# Altium project Main_board.PrjPcb
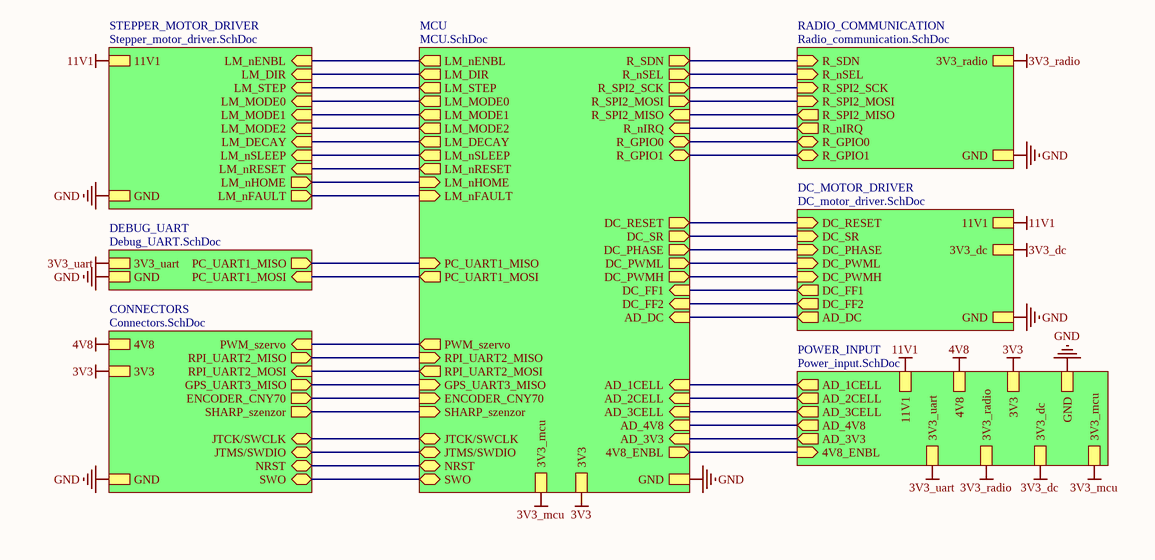
[diagram p0: TopLevelWiring.SchDoc]
8 sheets, 208 parts. Net scope: strictly hierarchical (ports join the sheet entries above them; power ports are local).
Board file: Main_board.PcbDoc
Sheets:
  TopLevelWiring.SchDoc
    CONNECTORS = Connectors.SchDoc
    DC_MOTOR_DRIVER = DC_motor_driver.SchDoc
    DEBUG_UART = Debug_UART.SchDoc
    RADIO_COMMUNICATION = Radio_communication.SchDoc
    STEPPER_MOTOR_DRIVER = Stepper_motor_driver.SchDoc
    POWER_INPUT = Power_input.SchDoc
    MCU = MCU.SchDoc

## Sheet TopLevelWiring.SchDoc
size A4; PageSetup: Record=PageOptions|CenterHorizontal=True|CenterVertical=True|PrintScale=1.00|XCorrection=1.00|YCorrection=1.00|PrintKind=0|BorderSize=5000000|LeftOffset=0|BottomOffset=0|Orientation=2|PaperLength=1000|PaperWidth=1000|Scale=100|PaperSource=7|PrintQuality=-3|MediaType=1|DitherType=10|PrintScaleMode=1|PaperKind=A4|PaperIndex=9

### Sub-sheets
CONNECTORS = Connectors.SchDoc: PWM_szervo (in), GND, 4V8, 3V3, RPI_UART2_MOSI (in), RPI_UART2_MISO (out), GPS_UART3_MISO (out), JTCK/SWCLK (bidir), JTMS/SWDIO (bidir), NRST (bidir), ENCODER_CNY70 (out), SWO (bidir), SHARP_szenzor (out)
DC_MOTOR_DRIVER = DC_motor_driver.SchDoc: 11V1, GND, DC_RESET (in), DC_SR (in), DC_PHASE (in), DC_PWML (in), DC_PWMH (in), DC_FF1 (out), DC_FF2 (out), AD_DC (out), 3V3_dc
DEBUG_UART = Debug_UART.SchDoc: 3V3_uart, GND, PC_UART1_MOSI (in), PC_UART1_MISO (out)
MCU = MCU.SchDoc: GND, LM_nENBL (out), LM_DIR (out), LM_STEP (out), LM_MODE0 (out), LM_MODE1 (out), LM_MODE2 (out), LM_DECAY (out), LM_nSLEEP (out), LM_nRESET (out), LM_nHOME (in), LM_nFAULT (in), R_SDN (out), R_nSEL (out), R_GPIO0 (bidir), R_GPIO1 (bidir), R_nIRQ (in), R_SPI2_SCK (out), R_SPI2_MISO (in), R_SPI2_MOSI (out), RPI_UART2_MOSI (out), RPI_UART2_MISO (in), GPS_UART3_MISO (in), PC_UART1_MOSI (out), PC_UART1_MISO (in), JTCK/SWCLK (bidir), JTMS/SWDIO (bidir), NRST (bidir), DC_RESET (out), DC_SR (out), DC_PHASE (out), DC_PWML (out), DC_PWMH (out), DC_FF1 (in), DC_FF2 (in), SWO (bidir), AD_3CELL (in), AD_4V8 (in), AD_3V3 (in), AD_2CELL (in), AD_1CELL (in), AD_DC (in), ENCODER_CNY70 (in), PWM_szervo (out), 4V8_ENBL (out), 3V3_mcu, 3V3, SHARP_szenzor (in)
POWER_INPUT = Power_input.SchDoc: 3V3, 4V8, 11V1, GND, AD_3CELL (out), AD_4V8 (out), AD_3V3 (out), AD_2CELL (out), AD_1CELL (out), 3V3_dc, 3V3_radio, 3V3_uart, 3V3_mcu, 4V8_ENBL (in)
RADIO_COMMUNICATION = Radio_communication.SchDoc: GND, R_SDN (in), R_nSEL (in), R_GPIO0 (bidir), R_GPIO1 (bidir), R_nIRQ (out), 3V3_radio, R_SPI2_SCK (in), R_SPI2_MISO (out), R_SPI2_MOSI (in)
STEPPER_MOTOR_DRIVER = Stepper_motor_driver.SchDoc: GND, LM_nENBL (in), LM_DIR (in), LM_STEP (in), LM_MODE0 (in), LM_MODE1 (in), LM_MODE2 (in), LM_DECAY (in), LM_nSLEEP (in), LM_nRESET (in), LM_nHOME (out), LM_nFAULT (out), 11V1

### Nets
3V3: sheet CONNECTORS/3V3, sheet POWER_INPUT/3V3, sheet MCU/3V3
3V3_dc: sheet DC_MOTOR_DRIVER/3V3_dc, sheet POWER_INPUT/3V3_dc
3V3_mcu: sheet POWER_INPUT/3V3_mcu, sheet MCU/3V3_mcu
3V3_radio: sheet RADIO_COMMUNICATION/3V3_radio, sheet POWER_INPUT/3V3_radio
3V3_uart: sheet DEBUG_UART/3V3_uart, sheet POWER_INPUT/3V3_uart
4V8: sheet CONNECTORS/4V8, sheet POWER_INPUT/4V8
11V1: sheet DC_MOTOR_DRIVER/11V1, sheet STEPPER_MOTOR_DRIVER/11V1, sheet POWER_INPUT/11V1
GND: sheet CONNECTORS/GND, sheet DC_MOTOR_DRIVER/GND, sheet DEBUG_UART/GND, sheet RADIO_COMMUNICATION/GND, sheet STEPPER_MOTOR_DRIVER/GND, sheet POWER_INPUT/GND, sheet MCU/GND
NetB1_2: sheet CONNECTORS/NRST, sheet MCU/NRST
NetGPS_3: sheet CONNECTORS/GPS_UART3_MISO, sheet MCU/GPS_UART3_MISO
NetIC2_7: sheet POWER_INPUT/4V8_ENBL, sheet MCU/4V8_ENBL
NetIC3_15: sheet DC_MOTOR_DRIVER/AD_DC, sheet MCU/AD_DC
NetIC3_16: sheet POWER_INPUT/AD_3V3, sheet MCU/AD_3V3
NetIC3_17: sheet POWER_INPUT/AD_1CELL, sheet MCU/AD_1CELL
NetIC3_18: sheet POWER_INPUT/AD_2CELL, sheet MCU/AD_2CELL
NetIC3_23: sheet CONNECTORS/PWM_szervo, sheet MCU/PWM_szervo
NetIC3_24: sheet CONNECTORS/ENCODER_CNY70, sheet MCU/ENCODER_CNY70
NetIC3_25: sheet CONNECTORS/RPI_UART2_MOSI, sheet MCU/RPI_UART2_MOSI
NetIC3_26: sheet CONNECTORS/RPI_UART2_MISO, sheet MCU/RPI_UART2_MISO
NetIC3_29: sheet POWER_INPUT/AD_3CELL, sheet MCU/AD_3CELL
NetIC3_30: sheet POWER_INPUT/AD_4V8, sheet MCU/AD_4V8
NetIC3_36: sheet CONNECTORS/SHARP_szenzor, sheet MCU/SHARP_szenzor
NetIC3_42: sheet RADIO_COMMUNICATION/R_SDN, sheet MCU/R_SDN
NetIC3_43: sheet RADIO_COMMUNICATION/R_nSEL, sheet MCU/R_nSEL
NetIC3_44: sheet RADIO_COMMUNICATION/R_GPIO0, sheet MCU/R_GPIO0
NetIC3_45: sheet RADIO_COMMUNICATION/R_GPIO1, sheet MCU/R_GPIO1
NetIC3_46: sheet RADIO_COMMUNICATION/R_nIRQ, sheet MCU/R_nIRQ
NetIC3_52: sheet RADIO_COMMUNICATION/R_SPI2_SCK, sheet MCU/R_SPI2_SCK
NetIC3_53: sheet RADIO_COMMUNICATION/R_SPI2_MISO, sheet MCU/R_SPI2_MISO
NetIC3_54: sheet RADIO_COMMUNICATION/R_SPI2_MOSI, sheet MCU/R_SPI2_MOSI
NetIC3_57: sheet STEPPER_MOTOR_DRIVER/LM_nHOME, sheet MCU/LM_nHOME
NetIC3_58: sheet STEPPER_MOTOR_DRIVER/LM_MODE2, sheet MCU/LM_MODE2
NetIC3_59: sheet STEPPER_MOTOR_DRIVER/LM_MODE1, sheet MCU/LM_MODE1
NetIC3_60: sheet STEPPER_MOTOR_DRIVER/LM_MODE0, sheet MCU/LM_MODE0
NetIC3_61: sheet STEPPER_MOTOR_DRIVER/LM_nENBL, sheet MCU/LM_nENBL
NetIC3_62: sheet STEPPER_MOTOR_DRIVER/LM_DIR, sheet MCU/LM_DIR
NetIC3_63: sheet STEPPER_MOTOR_DRIVER/LM_DECAY, sheet MCU/LM_DECAY
NetIC3_64: sheet STEPPER_MOTOR_DRIVER/LM_nFAULT, sheet MCU/LM_nFAULT
NetIC3_65: sheet STEPPER_MOTOR_DRIVER/LM_nSLEEP, sheet MCU/LM_nSLEEP
NetIC3_66: sheet STEPPER_MOTOR_DRIVER/LM_nRESET, sheet MCU/LM_nRESET
NetIC3_67: sheet STEPPER_MOTOR_DRIVER/LM_STEP, sheet MCU/LM_STEP
NetIC3_68: sheet DEBUG_UART/PC_UART1_MOSI, sheet MCU/PC_UART1_MOSI
NetIC3_69: sheet DEBUG_UART/PC_UART1_MISO, sheet MCU/PC_UART1_MISO
NetIC3_72: sheet CONNECTORS/JTMS/SWDIO, sheet MCU/JTMS/SWDIO
NetIC3_76: sheet CONNECTORS/JTCK/SWCLK, sheet MCU/JTCK/SWCLK
NetIC3_85: sheet DC_MOTOR_DRIVER/DC_FF2, sheet MCU/DC_FF2
NetIC3_86: sheet DC_MOTOR_DRIVER/DC_FF1, sheet MCU/DC_FF1
NetIC3_87: sheet DC_MOTOR_DRIVER/DC_RESET, sheet MCU/DC_RESET
NetIC3_88: sheet DC_MOTOR_DRIVER/DC_SR, sheet MCU/DC_SR
NetIC3_89: sheet CONNECTORS/SWO, sheet MCU/SWO
NetIC3_92: sheet DC_MOTOR_DRIVER/DC_PWMH, sheet MCU/DC_PWMH
NetIC3_93: sheet DC_MOTOR_DRIVER/DC_PWML, sheet MCU/DC_PWML
NetIC3_95: sheet DC_MOTOR_DRIVER/DC_PHASE, sheet MCU/DC_PHASE

## Sheet Connectors.SchDoc
size A4; PageSetup: Record=PageOptions|CenterHorizontal=True|CenterVertical=True|PrintScale=1.00|XCorrection=1.00|YCorrection=1.00|PrintKind=0|BorderSize=5000000|LeftOffset=0|BottomOffset=0|Orientation=2|PaperLength=1000|PaperWidth=1000|Scale=100|PaperSource=7|PrintQuality=-3|MediaType=1|DitherType=10|PrintScaleMode=1|PaperKind=A4|PaperIndex=9
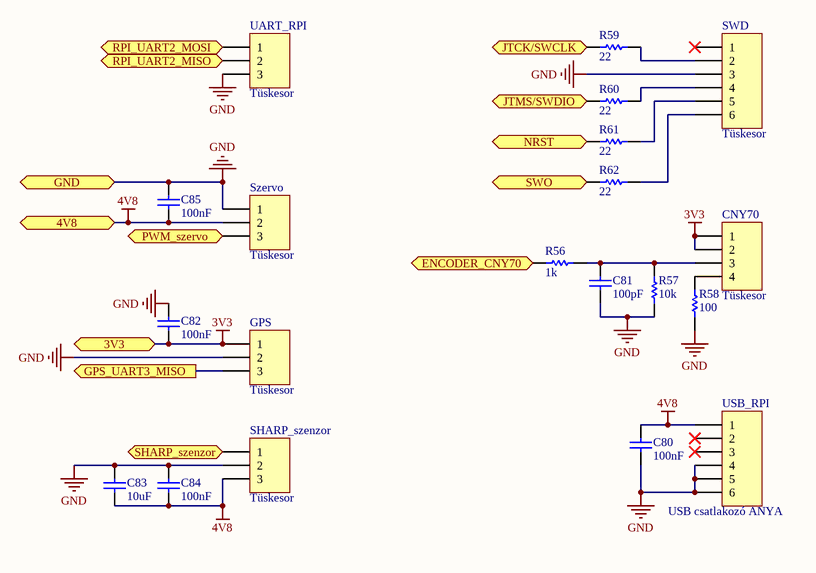
[diagram p1: Connectors.SchDoc]

### Parts
C80  value 100nF  [FP_0603_CAP_080]  (hidden comment: Cap)
C81  value 100pF  [FP_0603_CAP_080]  (hidden comment: Cap)
C82  value 100nF  [FP_0603_CAP_080]  (hidden comment: Cap)
C83  value 10uF  [FP_1206_CAP_125]  (hidden comment: Cap)
C84  value 100nF  [FP_0603_CAP_080]  (hidden comment: Cap)
C85  value 100nF  [FP_0603_CAP_080]  (hidden comment: Cap)
CNY70  Tüskesor  [FP_CONN4_TUSKE_254MM]
GPS  Tüskesor  [FP_CONN3_TUSKE_254MM]
R56  value 1k  [FP_0603_RES]  (hidden comment: Res1)
R57  value 10k  [FP_0603_RES]  (hidden comment: Res1)
R58  value 100  [FP_0603_RES]  (hidden comment: Res1)
R59  value 22  [FP_0603_RES]  (hidden comment: Res1)
R60  value 22  [FP_0603_RES]  (hidden comment: Res1)
R61  value 22  [FP_0603_RES]  (hidden comment: Res1)
R62  value 22  [FP_0603_RES]  (hidden comment: Res1)
SHARP_szenzor  Tüskesor  [HDR1X3]
SWD  Tüskesor  [HDR1X6]
Szervo  Tüskesor  [FP_CONN3_TUSKE_254MM]
UART_RPI  Tüskesor  [FP_CONN3_TUSKE_254MM]
USB_RPI  USB csatlakozó ANYA  [USB_vertical]

### Ports
3V3, 4V8, ENCODER_CNY70 (out), GND, GPS_UART3_MISO (out), JTCK/SWCLK (bidir), JTMS/SWDIO (bidir), NRST (bidir), PWM_szervo (in), RPI_UART2_MISO (out), RPI_UART2_MOSI (in), SHARP_szenzor (out), SWO (bidir)

### Nets
3V3: C82.1 CNY70.1 CNY70.2 GPS.1 ; port 3V3
4V8: C80.2 C83.2 C84.1 C85.1 SHARP_szenzor.3 Szervo.2 USB_RPI.1 ; port 4V8
GND: C80.1 C81.1 C82.2 C83.1 C84.2 C85.2 GPS.2 R57.1 R58.1 SHARP_szenzor.2 SWD.3 Szervo.1 UART_RPI.3 USB_RPI.4 USB_RPI.5 USB_RPI.6 ; port GND
NetB1_2: R61.2 ; port NRST
NetC81_2: C81.2 CNY70.3 R56.1 R57.2
NetCNY70_4: CNY70.4 R58.2
NetGPS_3: GPS.3 ; port GPS_UART3_MISO
NetIC3_23: Szervo.3 ; port PWM_szervo
NetIC3_24: R56.2 ; port ENCODER_CNY70
NetIC3_25: UART_RPI.1 ; port RPI_UART2_MOSI
NetIC3_26: UART_RPI.2 ; port RPI_UART2_MISO
NetIC3_36: SHARP_szenzor.1 ; port SHARP_szenzor
NetIC3_72: R60.2 ; port JTMS/SWDIO
NetIC3_76: R59.2 ; port JTCK/SWCLK
NetIC3_89: R62.2 ; port SWO
NetR59_1: R59.1 SWD.2
NetR60_1: R60.1 SWD.4
NetR61_1: R61.1 SWD.5
NetR62_1: R62.1 SWD.6

Not connected (* = marked no-connect by the designer): SWD 1*; USB_RPI 2* 3*

### Library data of the parts
C80-C85 = Cap: Capacitor; Published: 8-Jun-2000; LatestRevisionDate: 17-Jul-2002; LatestRevisionNote: Re-released for DXP Platform.; PackageReference: RAD-0.3; Publisher: Altium Limited; PackageDescription: Radial Cap, Thru-Hole; 2 Leads; 0.3 in Pin Spacing
CNY70 = Header 4: Header, 4-Pin; LatestRevisionDate: 17-Jul-2002; LatestRevisionNote: Re-released for DXP Platform.; Publisher: Altium Limited
GPS SHARP_szenzor Szervo UART_RPI = Header 3: Header, 3-Pin; LatestRevisionDate: 17-Jul-2002; LatestRevisionNote: Re-released for DXP Platform.; Publisher: Altium Limited
R56-R62 = Res1: Resistor; Published: 8-Jun-2000; LatestRevisionDate: 17-Jul-2002; LatestRevisionNote: Re-released for DXP Platform.; PackageReference: AXIAL-0.3; Publisher: Altium Limited; PackageDescription: Axial Device, Thru-Hole; 2 Leads; 0.3 in Pin Spacing
SWD USB_RPI = Header 6: Header, 6-Pin; LatestRevisionDate: 17-Jul-2002; LatestRevisionNote: Re-released for DXP Platform.; Publisher: Altium Limited

## Sheet DC_motor_driver.SchDoc
size A4; PageSetup: Record=PageOptions|CenterHorizontal=True|CenterVertical=True|PrintScale=1.00|XCorrection=1.00|YCorrection=1.00|PrintKind=0|BorderSize=5000000|LeftOffset=0|BottomOffset=0|Orientation=2|PaperLength=1000|PaperWidth=1000|Scale=100|PaperSource=7|PrintQuality=-3|MediaType=1|DitherType=10|PrintScaleMode=1|PaperKind=A4|PaperIndex=9
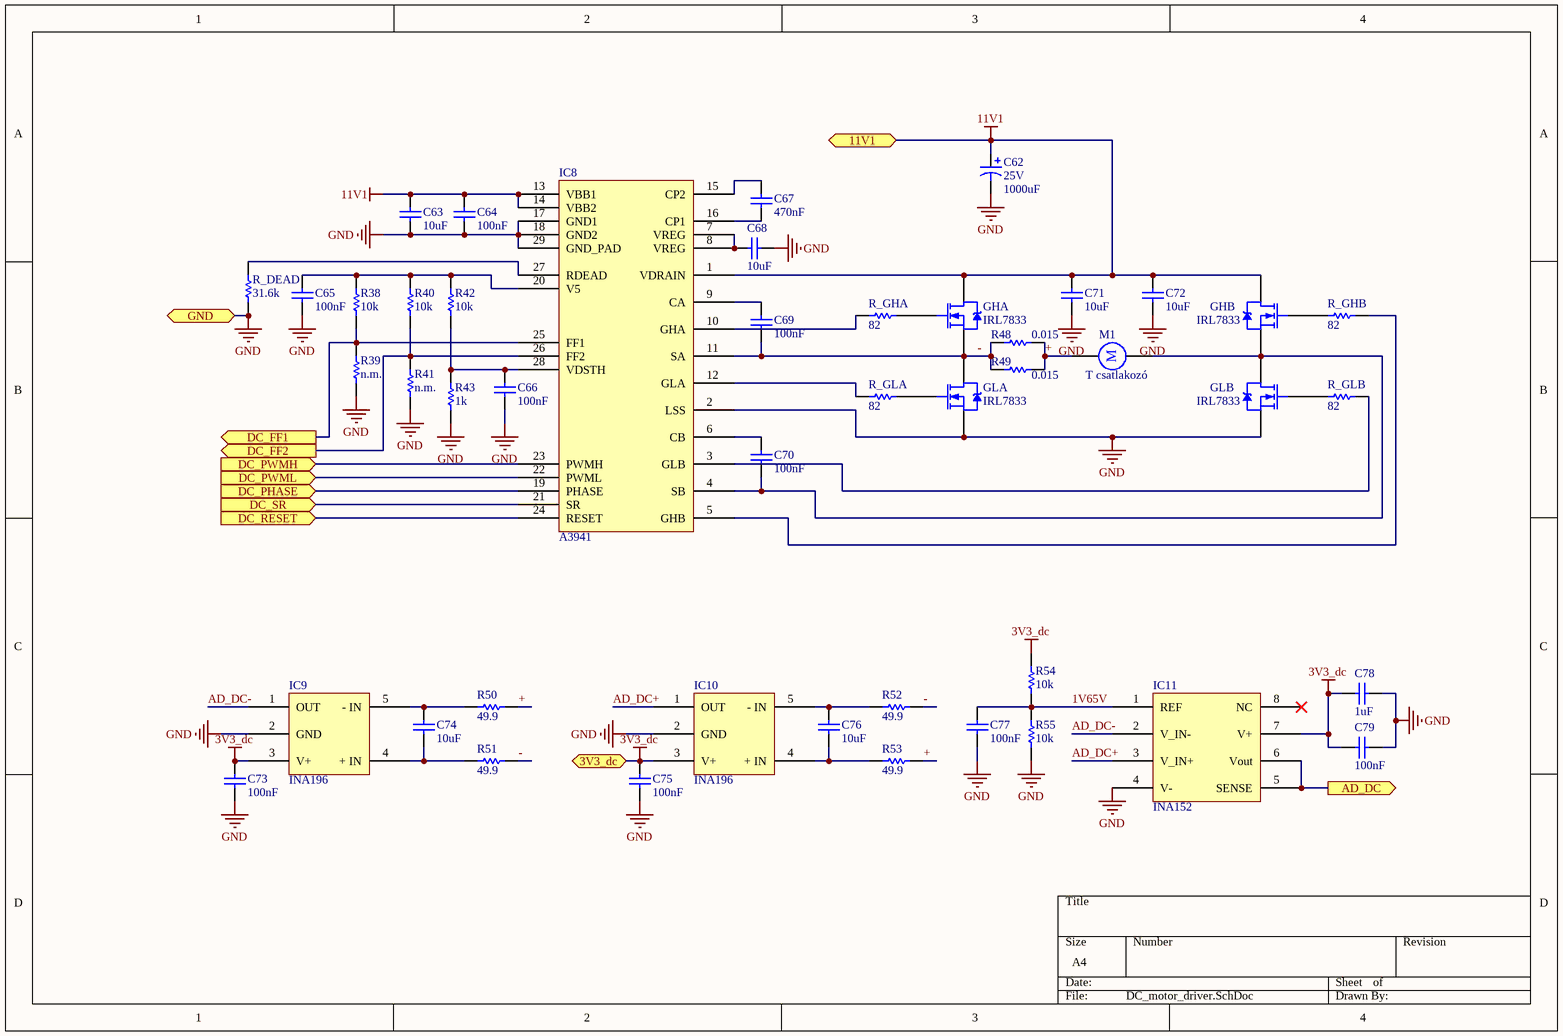
[diagram p2: DC_motor_driver.SchDoc]

### Parts
C62  25V  value 1000uF  [power_cap_13mm]
C63  value 10uF  [FP_1206_CAP_125]  (hidden comment: Cap)
C64  value 100nF  [FP_0603_CAP_080]  (hidden comment: Cap)
C65  value 100nF  [FP_0603_CAP_080]  (hidden comment: Cap)
C66  value 100nF  [FP_0603_CAP_080]  (hidden comment: Cap)
C67  value 470nF  [FP_0603_CAP_080]  (hidden comment: Cap)
C68  value 10uF  [FP_1206_CAP_125]  (hidden comment: Cap)
C69  value 100nF  [FP_0603_CAP_080]  (hidden comment: Cap)
C70  value 100nF  [FP_0603_CAP_080]  (hidden comment: Cap)
C71  value 10uF  [FP_1206_CAP_125]  (hidden comment: Cap)
C72  value 10uF  [FP_1206_CAP_125]  (hidden comment: Cap)
C73  value 100nF  [FP_0603_CAP_080]  (hidden comment: Cap)
C74  value 10uF  [FP_0603_CAP_080]  (hidden comment: Cap)
C75  value 100nF  [FP_0603_CAP_080]  (hidden comment: Cap)
C76  value 10uF  [FP_0603_CAP_080]  (hidden comment: Cap)
C77  value 100nF  [FP_0603_CAP_080]  (hidden comment: Cap)
C78  value 1uF  [FP_0603_CAP_080]  (hidden comment: Cap)
C79  value 100nF  [FP_0603_CAP_080]  (hidden comment: Cap)
GHA  IRL7833  [TO220AB]
GHB  IRL7833  [TO220AB]
GLA  IRL7833  [TO220AB]
GLB  IRL7833  [TO220AB]
IC8  A3941  [TSSOP28_thermal_pad]
IC9  INA196  [FP_SOT23-5]
IC10  INA196  [FP_SOT23-5]
IC11  INA152  [MSOP-MS8_M]
M1  T csatlakozó  [T-csatlakozo]
R38  value 10k  [FP_0603_CAP_080]  (hidden comment: Res1)
R39  value n.m.  [FP_0603_CAP_080]  (hidden comment: Res1)
R40  value 10k  [FP_0603_RES]  (hidden comment: Res1)
R41  value n.m.  [FP_0603_RES]  (hidden comment: Res1)
R42  value 10k  [FP_0603_CAP_080]  (hidden comment: Res1)
R43  value 1k  [FP_0603_RES]  (hidden comment: Res1)
R48  value 0.015  [RES_2512]  (hidden comment: Res1)
R49  value 0.015  [RES_2512]  (hidden comment: Res1)
R50  value 49.9  [FP_0603_RES]  (hidden comment: Res1)
R51  value 49.9  [FP_0603_RES]  (hidden comment: Res1)
R52  value 49.9  [FP_0603_RES]  (hidden comment: Res1)
R53  value 49.9  [FP_0603_RES]  (hidden comment: Res1)
R54  value 10k  [FP_0603_RES]  (hidden comment: Res1)
R55  value 10k  [FP_0603_RES]  (hidden comment: Res1)
R_DEAD  value 31.6k  [FP_0603_RES]  (hidden comment: 1us)
R_GHA  value 82  [FP_0603_RES]  (hidden comment: Res1)
R_GHB  value 82  [FP_0603_RES]  (hidden comment: Res1)
R_GLA  value 82  [FP_0603_RES]  (hidden comment: Res1)
R_GLB  value 82  [FP_0603_RES]  (hidden comment: Res1)

### Ports
3V3_dc, 11V1, AD_DC (out), DC_FF1 (out), DC_FF2 (out), DC_PHASE (in), DC_PWMH (in), DC_PWML (in), DC_RESET (in), DC_SR (in), GND

### Nets
3V3_dc: C73.2 C75.2 C78.1 C79.1 IC9.3(V+) IC10.3(V+) IC11.7(V+) R54.2 ; port 3V3_dc
11V1: C62.1 C63.2 C64.2 C71.1 C72.1 GHA.2(D) GHB.2(D) IC8.1(VDRAIN) IC8.13(VBB1) IC8.14(VBB2) ; port 11V1
GND: C62.2 C63.1 C64.1 C65.1 C66.1 C68.1 C71.2 C72.2 C73.1 C75.1 C77.1 C78.2 C79.2 GLA.3(S) GLB.3(S) IC8.2(LSS) IC8.17(GND1) IC8.18(GND2) IC8.29(GND_PAD) IC9.2(GND) IC10.2(GND) IC11.4(V-) R39.1 R41.1 R43.1 R55.1 R_DEAD.1 ; port GND
1V65V: C77.2 IC11.1(REF) R54.1 R55.2
+: M1.1 R48.2 R49.2 R50.2 R53.2
-: C69.2 GHA.3(S) GLA.2(D) IC8.11(SA) R48.1 R49.1 R51.2 R52.2
AD_DC+: IC10.1(OUT) IC11.3(V_IN+)
AD_DC-: IC9.1(OUT) IC11.2(V_IN-)
NetC65_2: C65.2 IC8.20(V5) R38.2 R40.2 R42.2
NetC66_2: C66.2 IC8.28(VDSTH) R42.1 R43.2
NetC67_1: C67.1 IC8.16(CP1)
NetC67_2: C67.2 IC8.15(CP2)
NetC68_2: C68.2 IC8.7(VREG) IC8.8(VREG)
NetC69_1: C69.1 IC8.9(CA)
NetC70_1: C70.1 IC8.6(CB)
NetC70_2: C70.2 GHB.3(S) GLB.2(D) IC8.4(SB) M1.2
NetC74_1: C74.1 IC9.4(+_IN) R51.1
NetC74_2: C74.2 IC9.5(-_IN) R50.1
NetC76_1: C76.1 IC10.4(+_IN) R53.1
NetC76_2: C76.2 IC10.5(-_IN) R52.1
NetGHA_1: GHA.1(G) R_GHA.1
NetGHB_1: GHB.1(G) R_GHB.2
NetGLA_1: GLA.1(G) R_GLA.1
NetGLB_1: GLB.1(G) R_GLB.2
NetIC3_15: IC11.5(SENSE) IC11.6(Vout) ; port AD_DC
NetIC3_85: IC8.26(FF2) R40.1 R41.2 ; port DC_FF2
NetIC3_86: IC8.25(FF1) R38.1 R39.2 ; port DC_FF1
NetIC3_87: IC8.24(RESET) ; port DC_RESET
NetIC3_88: IC8.21(SR) ; port DC_SR
NetIC3_92: IC8.23(PWMH) ; port DC_PWMH
NetIC3_93: IC8.22(PWML) ; port DC_PWML
NetIC3_95: IC8.19(PHASE) ; port DC_PHASE
NetIC8_3: IC8.3(GLB) R_GLB.1
NetIC8_5: IC8.5(GHB) R_GHB.1
NetIC8_10: IC8.10(GHA) R_GHA.2
NetIC8_12: IC8.12(GLA) R_GLA.2
NetIC8_27: IC8.27(RDEAD) R_DEAD.2

Not connected (* = marked no-connect by the designer): IC11 8(NC)*

### Notes on the sheet
- (in symbol Motor) M

### Library data of the parts
C62 = Cap Pol1: Polarized Capacitor (Radial); Published: 8-Jun-2000; LatestRevisionDate: 17-Jul-2002; LatestRevisionNote: Re-released for DXP Platform.; PackageReference: RB7.6-15; Publisher: Altium Limited; PackageDescription: Polarized Capacitor (Radial); 2 Leads
C63-C79 = Cap: Capacitor; Published: 8-Jun-2000; LatestRevisionDate: 17-Jul-2002; LatestRevisionNote: Re-released for DXP Platform.; PackageReference: RAD-0.3; Publisher: Altium Limited; PackageDescription: Radial Cap, Thru-Hole; 2 Leads; 0.3 in Pin Spacing
GHA GHB GLA GLB = NMOS-2: N-Channel Power MOSFET; Note: Pin 2 is electrically connected to pin 4.; Published: 8-Jun-2000; LatestRevisionDate: 17-Jul-2002; LatestRevisionNote: Re-released for DXP Platform.; DatasheetVersion: PD-9.814; PackageVersion: Feb-1997; PackageReference: TO-220AB; Publisher: Altium Limited; PackageDescription: TO, Thru-Hole, Vertical, Heatsink Mounted; 3 In-Line Leads; Pitch 2.54 mm; ComponentLink1Description: Manufacturer Link; ComponentLink1URL: http://www.irf.com/
M1 = Motor: Motor, General Kind; Published: 24-Mar-1999; LatestRevisionDate: 17-Jul-2002; LatestRevisionNote: Re-released for DXP Platform.; PackageReference: RB5-10.5; Publisher: Altium Limited; PackageDescription: Capacitor (Radial); 2 Leads
R38-R43 R48-R55 R_DEAD R_GHA R_GHB R_GLA R_GLB = Res1: Resistor; Published: 8-Jun-2000; LatestRevisionDate: 17-Jul-2002; LatestRevisionNote: Re-released for DXP Platform.; PackageReference: AXIAL-0.3; Publisher: Altium Limited; PackageDescription: Axial Device, Thru-Hole; 2 Leads; 0.3 in Pin Spacing

## Sheet Debug_UART.SchDoc
size A4; PageSetup: Record=PageOptions|CenterHorizontal=True|CenterVertical=True|PrintScale=1.00|XCorrection=1.00|YCorrection=1.00|PrintKind=0|BorderSize=5000000|LeftOffset=0|BottomOffset=0|Orientation=2|PaperLength=1000|PaperWidth=1000|Scale=100|PaperSource=7|PrintQuality=-3|MediaType=1|DitherType=10|PrintScaleMode=1|PaperKind=A4|PaperIndex=9
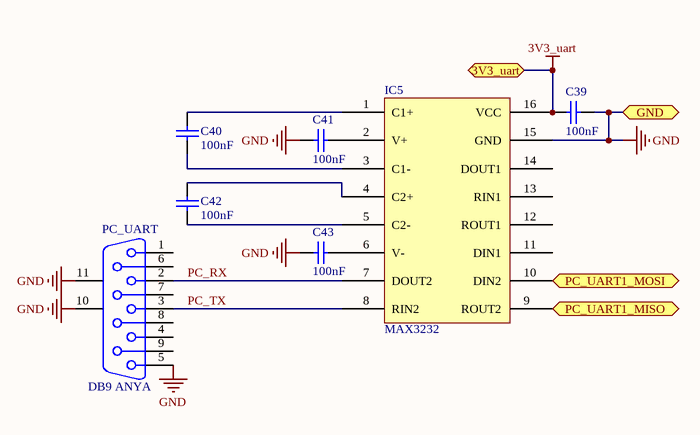
[diagram p3: Debug_UART.SchDoc]

### Parts
C39  value 100nF  [FP_0603_CAP_080]  (hidden comment: Cap)
C40  value 100nF  [FP_0603_CAP_080]  (hidden comment: Cap)
C41  value 100nF  [FP_0603_CAP_080]  (hidden comment: Cap)
C42  value 100nF  [FP_0603_CAP_080]  (hidden comment: Cap)
C43  value 100nF  [FP_0603_CAP_080]  (hidden comment: Cap)
IC5  MAX3232  [SOIC16]
PC_UART  DB9 ANYA  [DB9_connector]

### Ports
3V3_uart, GND, PC_UART1_MISO (out), PC_UART1_MOSI (in)

### Nets
3V3_uart: C39.2 IC5.16(VCC) ; port 3V3_uart
GND: C39.1 C41.1 C43.1 IC5.15(GND) PC_UART.5 PC_UART.10(MH1) PC_UART.11(MH2) ; port GND
PC_RX: IC5.7(DOUT2) PC_UART.2
PC_TX: IC5.8(RIN2) PC_UART.3
NetC40_1: C40.1 IC5.3(C1-)
NetC40_2: C40.2 IC5.1(C1+)
NetC41_2: C41.2 IC5.2(V+)
NetC42_1: C42.1 IC5.5(C2-)
NetC42_2: C42.2 IC5.4(C2+)
NetC43_2: C43.2 IC5.6(V-)
NetIC3_68: IC5.10(DIN2) ; port PC_UART1_MOSI
NetIC3_69: IC5.9(ROUT2) ; port PC_UART1_MISO

Not connected (* = marked no-connect by the designer): IC5 11(DIN1) 12(ROUT1) 13(RIN1) 14(DOUT1); PC_UART 1 4 6 7 8 9

### Library data of the parts
C39-C43 = Cap: Capacitor; Published: 8-Jun-2000; LatestRevisionDate: 17-Jul-2002; LatestRevisionNote: Re-released for DXP Platform.; PackageReference: RAD-0.3; Publisher: Altium Limited; PackageDescription: Radial Cap, Thru-Hole; 2 Leads; 0.3 in Pin Spacing
PC_UART = D Connector 9: Receptacle Assembly, 9 Position, Right Angle; PackageDocument: O; Positions: 9; Published: 15-Jun-2001; LatestRevisionDate: 17-Jul-2002; LatestRevisionNote: Re-released for DXP Platform.; DatasheetDocument: 1-Sep-1999; PackageReference: 788750; Publisher: Altium Limited; Orientation: Right Angle; Gender: Receptacle

## Sheet Radio_communication.SchDoc
size A4; PageSetup: Record=PageOptions|CenterHorizontal=True|CenterVertical=True|PrintScale=1.00|XCorrection=1.00|YCorrection=1.00|PrintKind=0|BorderSize=5000000|LeftOffset=0|BottomOffset=0|Orientation=2|PaperLength=1000|PaperWidth=1000|Scale=100|PaperSource=7|PrintQuality=-3|MediaType=1|DitherType=10|PrintScaleMode=1|PaperKind=A4|PaperIndex=9
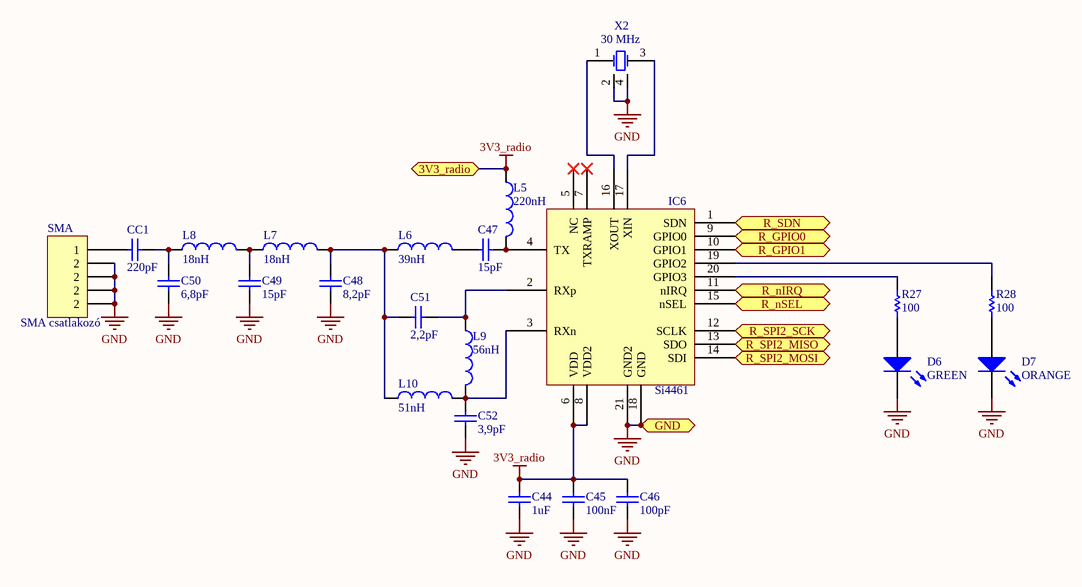
[diagram p4: Radio_communication.SchDoc]

### Parts
C44  value 1uF  [FP_0603_CAP_080]  (hidden comment: Cap)
C45  value 100nF  [FP_0603_CAP_080]  (hidden comment: Cap)
C46  value 100pF  [FP_0603_CAP_080]  (hidden comment: Cap)
C47  value 15pF  [FP_0603_CAP_080]  (hidden comment: Cap)
C48  value 8,2pF  [FP_0603_CAP_080]  (hidden comment: Cap)
C49  value 15pF  [FP_0603_CAP_080]  (hidden comment: Cap)
C50  value 6,8pF  [FP_0603_CAP_080]  (hidden comment: Cap)
C51  value 2,2pF  [FP_0603_CAP_080]  (hidden comment: Cap)
C52  value 3,9pF  [FP_0603_CAP_080]  (hidden comment: Cap)
CC1  value 220pF  [FP_0603_CAP_080]  (hidden comment: Cap)
D6  GREEN  [FP_0805_LED_GREEN]
D7  ORANGE  [FP_0805_LED_GREEN]
IC6  Si4461  [QFN20_thermal_pad]
L5  value 220nH  [FP_0603_CAP_080]  (hidden comment: Inductor)
L6  value 39nH  [FP_0603_CAP_080]  (hidden comment: Inductor)
L7  value 18nH  [FP_0603_CAP_080]  (hidden comment: Inductor)
L8  value 18nH  [FP_0603_CAP_080]  (hidden comment: Inductor)
L9  value 56nH  [FP_0603_CAP_080]  (hidden comment: Inductor)
L10  value 51nH  [FP_0603_CAP_080]  (hidden comment: Inductor)
R27  value 100  [FP_0603_RES]  (hidden comment: Res1)
R28  value 100  [FP_0603_RES]  (hidden comment: Res1)
SMA  SMA csatlakozó  [SMA_connector]
X2  30 MHz  [crystal_sx2520]

### Ports
3V3_radio, GND, R_GPIO0, R_GPIO1, R_nIRQ (out), R_nSEL (in), R_SDN (in), R_SPI2_MISO (out), R_SPI2_MOSI (in), R_SPI2_SCK (in)

### Nets
3V3_radio: C44.2 C45.2 C46.2 IC6.6(VDD) IC6.8(VDD2) L5.1 ; port 3V3_radio
GND: C44.1 C45.1 C46.1 C48.2 C49.2 C50.2 C52.1 D6.2(K) D7.2(K) IC6.18(GND) IC6.21(GND2) SMA.2 X2.2(OSC2) X2.4 ; port GND
NetC47_1: C47.1 IC6.4(TX) L5.2
NetC47_2: C47.2 L6.2
NetC48_1: C48.1 C51.1 L6.1 L7.2 L10.1
NetC49_1: C49.1 L7.1 L8.2
NetC50_1: C50.1 CC1.2 L8.1
NetC51_2: C51.2 IC6.2(RXp) L9.1
NetC52_2: C52.2 IC6.3(RXn) L9.2 L10.2
NetCC1_1: CC1.1 SMA.1
NetD6_1: D6.1(A) R27.1
NetD7_1: D7.1(A) R28.1
NetIC3_42: IC6.1(SDN) ; port R_SDN
NetIC3_43: IC6.15(nSEL) ; port R_nSEL
NetIC3_44: IC6.9(GPIO0) ; port R_GPIO0
NetIC3_45: IC6.10(GPIO1) ; port R_GPIO1
NetIC3_46: IC6.11(nIRQ) ; port R_nIRQ
NetIC3_52: IC6.12(SCLK) ; port R_SPI2_SCK
NetIC3_53: IC6.13(SDO) ; port R_SPI2_MISO
NetIC3_54: IC6.14(SDI) ; port R_SPI2_MOSI
NetIC6_16: IC6.16(XOUT) X2.1(OSC1)
NetIC6_17: IC6.17(XIN) X2.3
NetIC6_19: IC6.19(GPIO2) R28.2
NetIC6_20: IC6.20(GPIO3) R27.2

Not connected (* = marked no-connect by the designer): IC6 5(NC)* 7(TXRAMP)*

### Library data of the parts
C44-C52 CC1 = Cap: Capacitor; Published: 8-Jun-2000; LatestRevisionDate: 17-Jul-2002; LatestRevisionNote: Re-released for DXP Platform.; PackageReference: RAD-0.3; Publisher: Altium Limited; PackageDescription: Radial Cap, Thru-Hole; 2 Leads; 0.3 in Pin Spacing
D6 D7 = LED: Typical RED GaAs LED; pin to pad: 1>A 2>K
L5-L10 = Inductor: Code_IEC: 1005; Published: 8-Jun-2000; LatestRevisionDate: 29-May-2009; LatestRevisionNote: IPC-7351 Footprint Added.; PackageReference: 0402-A; Publisher: Altium Limited; PackageDescription: Chip Inductor; Code_JEITA: 0402
R27 R28 = Res1: Resistor; Published: 8-Jun-2000; LatestRevisionDate: 17-Jul-2002; LatestRevisionNote: Re-released for DXP Platform.; PackageReference: AXIAL-0.3; Publisher: Altium Limited; PackageDescription: Axial Device, Thru-Hole; 2 Leads; 0.3 in Pin Spacing
SMA = Header 5: Header, 5-Pin; LatestRevisionDate: 17-Jul-2002; LatestRevisionNote: Re-released for DXP Platform.; Publisher: Altium Limited
X2 = XTAL: Crystal Oscillator; Published: 8-Jun-2000; LatestRevisionDate: 17-Jul-2002; LatestRevisionNote: Re-released for DXP Platform.; PackageReference: R38; Publisher: Altium Limited; PackageDescription: Crystal, Thru-Hole; 2 Leads; Body 3.1 x 8.2 mm (Dia.xH)

## Sheet Stepper_motor_driver.SchDoc
size A4; PageSetup: Record=PageOptions|CenterHorizontal=True|CenterVertical=True|PrintScale=1.00|XCorrection=1.00|YCorrection=1.00|PrintKind=0|BorderSize=5000000|LeftOffset=0|BottomOffset=0|Orientation=2|PaperLength=1000|PaperWidth=1000|Scale=100|PaperSource=7|PrintQuality=-3|MediaType=1|DitherType=10|PrintScaleMode=1|PaperKind=A4|PaperIndex=9
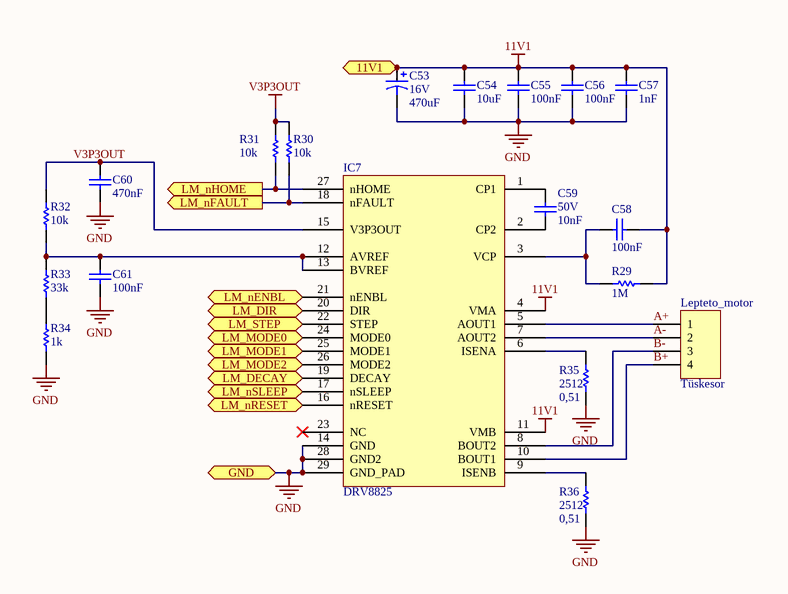
[diagram p5: Stepper_motor_driver.SchDoc]

### Parts
C53  16V  value 470uF  [power_cap_10mm]
C54  value 10uF  [FP_1206_CAP_125]  (hidden comment: 50V)
C55  value 100nF  [FP_0603_CAP_080]  (hidden comment: 50V)
C56  value 100nF  [FP_0603_CAP_080]  (hidden comment: 50V)
C57  value 1nF  [FP_0603_CAP_080]  (hidden comment: 50V)
C58  value 100nF  [FP_0603_CAP_080]  (hidden comment: 16V)
C59  50V  value 10nF  [FP_0603_CAP_080]
C60  value 470nF  [FP_0603_CAP_080]  (hidden comment: 50V)
C61  value 100nF  [FP_0603_CAP_080]  (hidden comment: 50V)
IC7  DRV8825  [TSSOP28_thermal_pad]
Lepteto_motor  Tüskesor  [FP_CONN4_TUSKE_254MM]
R29  value 1M  [FP_0603_RES]  (hidden comment: Res1)
R30  value 10k  [FP_0603_RES]  (hidden comment: Res Semi)
R31  value 10k  [FP_0603_RES]  (hidden comment: Res Semi)
R32  value 10k  [FP_0603_RES]  (hidden comment: Res Semi)
R33  value 33k  [FP_0603_RES]  (hidden comment: Res Semi)
R34  value 1k  [FP_0603_RES]  (hidden comment: Res Semi)
R35  2512  value 0,51  [RES_2512]
R36  2512  value 0,51  [RES_2512]

### Ports
11V1, GND, LM_DECAY (in), LM_DIR (in), LM_MODE0 (in), LM_MODE1 (in), LM_MODE2 (in), LM_nENBL (in), LM_nFAULT (out), LM_nHOME (out), LM_nRESET (in), LM_nSLEEP (in), LM_STEP (in)

### Nets
11V1: C53.1 C54.2 C55.2 C56.2 C57.1 C58.2 IC7.4(VMA) IC7.11(VMB) R29.1 ; port 11V1
GND: C53.2 C54.1 C55.1 C56.1 C57.2 C60.1 C61.1 IC7.14(GND) IC7.28(GND2) IC7.29(GND_PAD) R34.1 R35.1 R36.1 ; port GND
V3P3OUT: C60.2 IC7.15(V3P3OUT) R30.2 R31.2 R32.2
A+: IC7.5(AOUT1) Lepteto_motor.1
A-: IC7.7(AOUT2) Lepteto_motor.2
B+: IC7.10(BOUT1) Lepteto_motor.4
B-: IC7.8(BOUT2) Lepteto_motor.3
NetC58_1: C58.1 IC7.3(VCP) R29.2
NetC59_1: C59.1 IC7.2(CP2)
NetC59_2: C59.2 IC7.1(CP1)
NetC61_2: C61.2 IC7.12(AVREF) IC7.13(BVREF) R32.1 R33.2
NetIC3_57: IC7.27(nHOME) R31.1 ; port LM_nHOME
NetIC3_58: IC7.26(MODE2) ; port LM_MODE2
NetIC3_59: IC7.25(MODE1) ; port LM_MODE1
NetIC3_60: IC7.24(MODE0) ; port LM_MODE0
NetIC3_61: IC7.21(nENBL) ; port LM_nENBL
NetIC3_62: IC7.20(DIR) ; port LM_DIR
NetIC3_63: IC7.19(DECAY) ; port LM_DECAY
NetIC3_64: IC7.18(nFAULT) R30.1 ; port LM_nFAULT
NetIC3_65: IC7.17(nSLEEP) ; port LM_nSLEEP
NetIC3_66: IC7.16(nRESET) ; port LM_nRESET
NetIC3_67: IC7.22(STEP) ; port LM_STEP
NetIC7_6: IC7.6(ISENA) R35.2
NetIC7_9: IC7.9(ISENB) R36.2
NetR33_1: R33.1 R34.2

Not connected (* = marked no-connect by the designer): IC7 23(NC)*

### Library data of the parts
C53 = Cap Pol1: Polarized Capacitor (Radial); Published: 8-Jun-2000; LatestRevisionDate: 17-Jul-2002; LatestRevisionNote: Re-released for DXP Platform.; PackageReference: RB7.6-15; Publisher: Altium Limited; PackageDescription: Polarized Capacitor (Radial); 2 Leads
C54-C61 = Cap: Capacitor; Published: 8-Jun-2000; LatestRevisionDate: 17-Jul-2002; LatestRevisionNote: Re-released for DXP Platform.; PackageReference: RAD-0.3; Publisher: Altium Limited; PackageDescription: Radial Cap, Thru-Hole; 2 Leads; 0.3 in Pin Spacing
Lepteto_motor = Header 4: Header, 4-Pin; LatestRevisionDate: 17-Jul-2002; LatestRevisionNote: Re-released for DXP Platform.; Publisher: Altium Limited
R29-R36 = Res Semi: Semiconductor Resistor; Published: 8-Jun-2000; LatestRevisionDate: 17-Jul-2002; LatestRevisionNote: Re-released for DXP Platform.; PackageReference: AXIAL-0.5; Publisher: Altium Limited; PackageDescription: Axial Device, Thru-Hole; 2 Leads; 0.5 in Pin Spacing

## Sheet Power_input.SchDoc
size A4; PageSetup: Record=PageOptions|CenterHorizontal=True|CenterVertical=True|PrintScale=1.00|XCorrection=1.00|YCorrection=1.00|PrintKind=0|BorderSize=5000000|LeftOffset=0|BottomOffset=0|Orientation=2|PaperLength=1000|PaperWidth=1000|Scale=100|PaperSource=7|PrintQuality=-3|MediaType=1|DitherType=10|PrintScaleMode=1|PaperKind=A4|PaperIndex=9
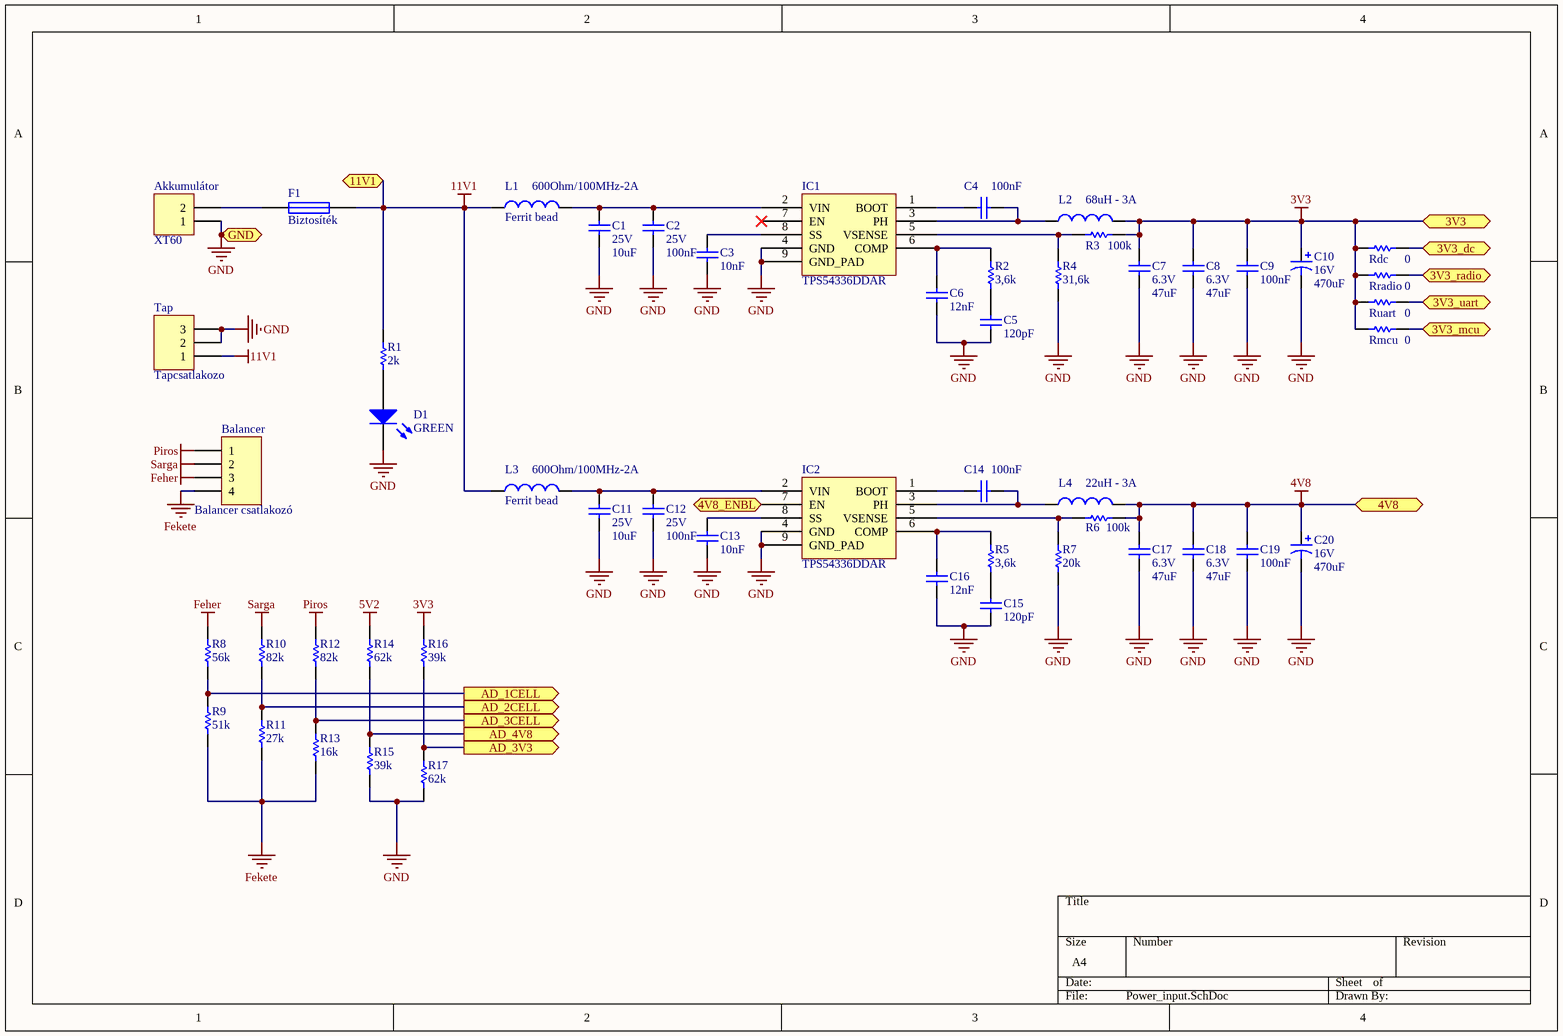
[diagram p6: Power_input.SchDoc]

### Parts
Akkumulátor  XT60  [XT60]
Balancer  Balancer csatlakozó  [FP_CONN4_TUSKE_254MM]
C1  25V  value 10uF  [FP_1206_CAP_125]
C2  25V  value 100nF  [FP_1206_CAP_125]
C3  value 10nF  [FP_0603_CAP_080]  (hidden comment: Cap)
C4  value 100nF  [FP_1206_CAP_125]  (hidden comment: Cap)
C5  value 120pF  [FP_0603_CAP_080]
C6  value 12nF  [FP_0603_CAP_080]
C7  6.3V  value 47uF  [FP_1206_CAP_125]
C8  6.3V  value 47uF  [FP_1206_CAP_125]
C9  value 100nF  [FP_1206_CAP_125]  (hidden comment: Cap)
C10  16V  value 470uF  [power_cap_10mm]
C11  25V  value 10uF  [FP_1206_CAP_125]
C12  25V  value 100nF  [FP_1206_CAP_125]
C13  value 10nF  [FP_0603_CAP_080]  (hidden comment: Cap)
C14  value 100nF  [FP_1206_CAP_125]  (hidden comment: Cap)
C15  value 120pF  [FP_0603_CAP_080]
C16  value 12nF  [FP_0603_CAP_080]
C17  6.3V  value 47uF  [FP_1206_CAP_125]
C18  6.3V  value 47uF  [FP_1206_CAP_125]
C19  value 100nF  [FP_1206_CAP_125]  (hidden comment: Cap)
C20  16V  value 470uF  [power_cap_10mm]
D1  GREEN  [FP_1206_CAP_160]
F1  Biztosíték  [autosarus_foglalat]
IC1  TPS54336DDAR  [SOIC8_thermal_pad]
IC2  TPS54336DDAR  [SOIC8_thermal_pad]
L1  Ferrit bead  value 600Ohm/100MHz-2A  [FP_0805_IND]
L2  value 68uH - 3A  [power_inductor]  (hidden comment: Inductor)
L3  Ferrit bead  value 600Ohm/100MHz-2A  [FP_0805_IND]
L4  value 22uH - 3A  [power_inductor]  (hidden comment: Inductor)
R1  value 2k  [FP_0603_RES]  (hidden comment: Res1)
R2  value 3,6k  [FP_0603_RES]  (hidden comment: Res1)
R3  value 100k  [FP_0603_RES]  (hidden comment: Res1)
R4  value 31,6k  [FP_0603_RES]  (hidden comment: Res1)
R5  value 3,6k  [FP_0603_RES]  (hidden comment: Res1)
R6  value 100k  [FP_0603_RES]  (hidden comment: Res1)
R7  value 20k  [FP_0603_RES]  (hidden comment: Res1)
R8  value 56k  [FP_0603_RES]  (hidden comment: Res1)
R9  value 51k  [FP_0603_RES]  (hidden comment: Res1)
R10  value 82k  [FP_0603_RES]  (hidden comment: Res1)
R11  value 27k  [FP_0603_RES]  (hidden comment: Res1)
R12  value 82k  [FP_0603_RES]  (hidden comment: Res1)
R13  value 16k  [FP_0603_RES]  (hidden comment: Res1)
R14  value 62k  [FP_0603_RES]  (hidden comment: Res1)
R15  value 39k  [FP_0603_RES]  (hidden comment: Res1)
R16  value 39k  [FP_0603_RES]  (hidden comment: Res1)
R17  value 62k  [FP_0603_RES]  (hidden comment: Res1)
Rdc  value 0  [FP_1206_RES]  (hidden comment: Res1)
Rmcu  value 0  [FP_1206_RES]  (hidden comment: Res1)
Rradio  value 0  [FP_1206_RES]  (hidden comment: Res1)
Ruart  value 0  [FP_1206_RES]  (hidden comment: Res1)
Tap  Tapcsatlakozo  [FP_DC_TAP_ANYA]

### Ports
3V3, 3V3_dc, 3V3_mcu, 3V3_radio, 3V3_uart, 4V8, 4V8_ENBL (in), 11V1, AD_1CELL (out), AD_2CELL (out), AD_3CELL (out), AD_3V3 (out), AD_4V8 (out), GND

### Nets
3V3: C7.1 C8.1 C9.1 C10.1 L2.2 R3.1 R16.2 Rdc.2 Rmcu.2 Rradio.2 Ruart.2 ; port 3V3
3V3_dc: Rdc.1 ; port 3V3_dc
3V3_mcu: Rmcu.1 ; port 3V3_mcu
3V3_radio: Rradio.1 ; port 3V3_radio
3V3_uart: Ruart.1 ; port 3V3_uart
4V8: C17.1 C18.1 C19.1 C20.1 L4.2 R6.1 ; port 4V8
5V2: R14.2
11V1: F1.2 L1.1 L3.1 R1.2 Tap.1 ; port 11V1
Feher: Balancer.3 R8.2
Fekete: Balancer.4 R9.1 R11.1 R13.1
GND: Akkumulátor.1 C1.2 C2.2 C3.2 C5.2 C6.2 C7.2 C8.2 C9.2 C10.2 C11.2 C12.2 C13.2 C15.2 C16.2 C17.2 C18.2 C19.2 C20.2 D1.2(K) IC1.4(GND) IC1.9(GND_PAD) IC2.4(GND) IC2.9(GND_PAD) R4.1 R7.1 R15.1 R17.1 Tap.2 Tap.3 ; port GND
Piros: Balancer.1 R12.2
Sarga: Balancer.2 R10.2
NetAkkumulátor_2: Akkumulátor.2 F1.1
NetC1_1: C1.1 C2.1 IC1.2(VIN) L1.2
NetC3_1: C3.1 IC1.8(SS)
NetC4_1: C4.1 IC1.1(BOOT)
NetC4_2: C4.2 IC1.3(PH) L2.1
NetC5_1: C5.1 R2.1
NetC6_1: C6.1 IC1.6(COMP) R2.2
NetC11_1: C11.1 C12.1 IC2.2(VIN) L3.2
NetC13_1: C13.1 IC2.8(SS)
NetC14_1: C14.1 IC2.1(BOOT)
NetC14_2: C14.2 IC2.3(PH) L4.1
NetC15_1: C15.1 R5.1
NetC16_1: C16.1 IC2.6(COMP) R5.2
NetD1_1: D1.1(A) R1.1
NetIC1_5: IC1.5(VSENSE) R3.2 R4.2
NetIC2_5: IC2.5(VSENSE) R6.2 R7.2
NetIC2_7: IC2.7(EN) ; port 4V8_ENBL
NetIC3_16: R16.1 R17.2 ; port AD_3V3
NetIC3_17: R8.1 R9.2 ; port AD_1CELL
NetIC3_18: R10.1 R11.2 ; port AD_2CELL
NetIC3_29: R12.1 R13.2 ; port AD_3CELL
NetIC3_30: R14.1 R15.2 ; port AD_4V8

Not connected (* = marked no-connect by the designer): IC1 7(EN)*

### Library data of the parts
Akkumulátor = Header 2: Header, 2-Pin; LatestRevisionDate: 17-Jul-2002; LatestRevisionNote: Re-released for DXP Platform.; Publisher: Altium Limited
Balancer = Header 4: Header, 4-Pin; LatestRevisionDate: 17-Jul-2002; LatestRevisionNote: Re-released for DXP Platform.; Publisher: Altium Limited
C1-C9 C11-C19 = Cap: Capacitor; Published: 8-Jun-2000; LatestRevisionDate: 17-Jul-2002; LatestRevisionNote: Re-released for DXP Platform.; PackageReference: RAD-0.3; Publisher: Altium Limited; PackageDescription: Radial Cap, Thru-Hole; 2 Leads; 0.3 in Pin Spacing
C10 C20 = Cap Pol1: Polarized Capacitor (Radial); Published: 8-Jun-2000; LatestRevisionDate: 17-Jul-2002; LatestRevisionNote: Re-released for DXP Platform.; PackageReference: RB7.6-15; Publisher: Altium Limited; PackageDescription: Polarized Capacitor (Radial); 2 Leads
D1 = LED0: Typical INFRARED GaAs LED; Published: 8-Jun-2000; LatestRevisionDate: 08-Jul-2005; LatestRevisionNote: Mech Layer 1 removed.; PackageReference: LED-0; Publisher: Altium Limited; PackageDescription: LED; 2 Leads
F1 = Fuse 1: Fuse; Published: 8-Jun-2000; LatestRevisionDate: 17-Jul-2002; LatestRevisionNote: Re-released for DXP Platform.; PackageReference: PIN-W2/E2.8; Publisher: Altium Limited; PackageDescription: Thru-Hole; 2 Leads
IC1 IC2 = TPS54336
L1-L4 = Inductor: Code_IEC: 1005; Published: 8-Jun-2000; LatestRevisionDate: 29-May-2009; LatestRevisionNote: IPC-7351 Footprint Added.; PackageReference: 0402-A; Publisher: Altium Limited; PackageDescription: Chip Inductor; Code_JEITA: 0402
R1-R17 Rdc Rmcu Rradio Ruart = Res1: Resistor; Published: 8-Jun-2000; LatestRevisionDate: 17-Jul-2002; LatestRevisionNote: Re-released for DXP Platform.; PackageReference: AXIAL-0.3; Publisher: Altium Limited; PackageDescription: Axial Device, Thru-Hole; 2 Leads; 0.3 in Pin Spacing
Tap = Header 3: Header, 3-Pin; LatestRevisionDate: 17-Jul-2002; LatestRevisionNote: Re-released for DXP Platform.; Publisher: Altium Limited

## Sheet MCU.SchDoc
size A3; PageSetup: Record=PageOptions|CenterHorizontal=True|CenterVertical=True|PrintScale=0.73|XCorrection=1.00|YCorrection=1.00|PrintKind=0|BorderSize=5000000|LeftOffset=0|BottomOffset=0|Orientation=2|PaperLength=1000|PaperWidth=1000|Scale=100|PaperSource=7|PrintQuality=-3|MediaType=1|DitherType=10|PrintScaleMode=1|PaperKind=A4|PaperIndex=9
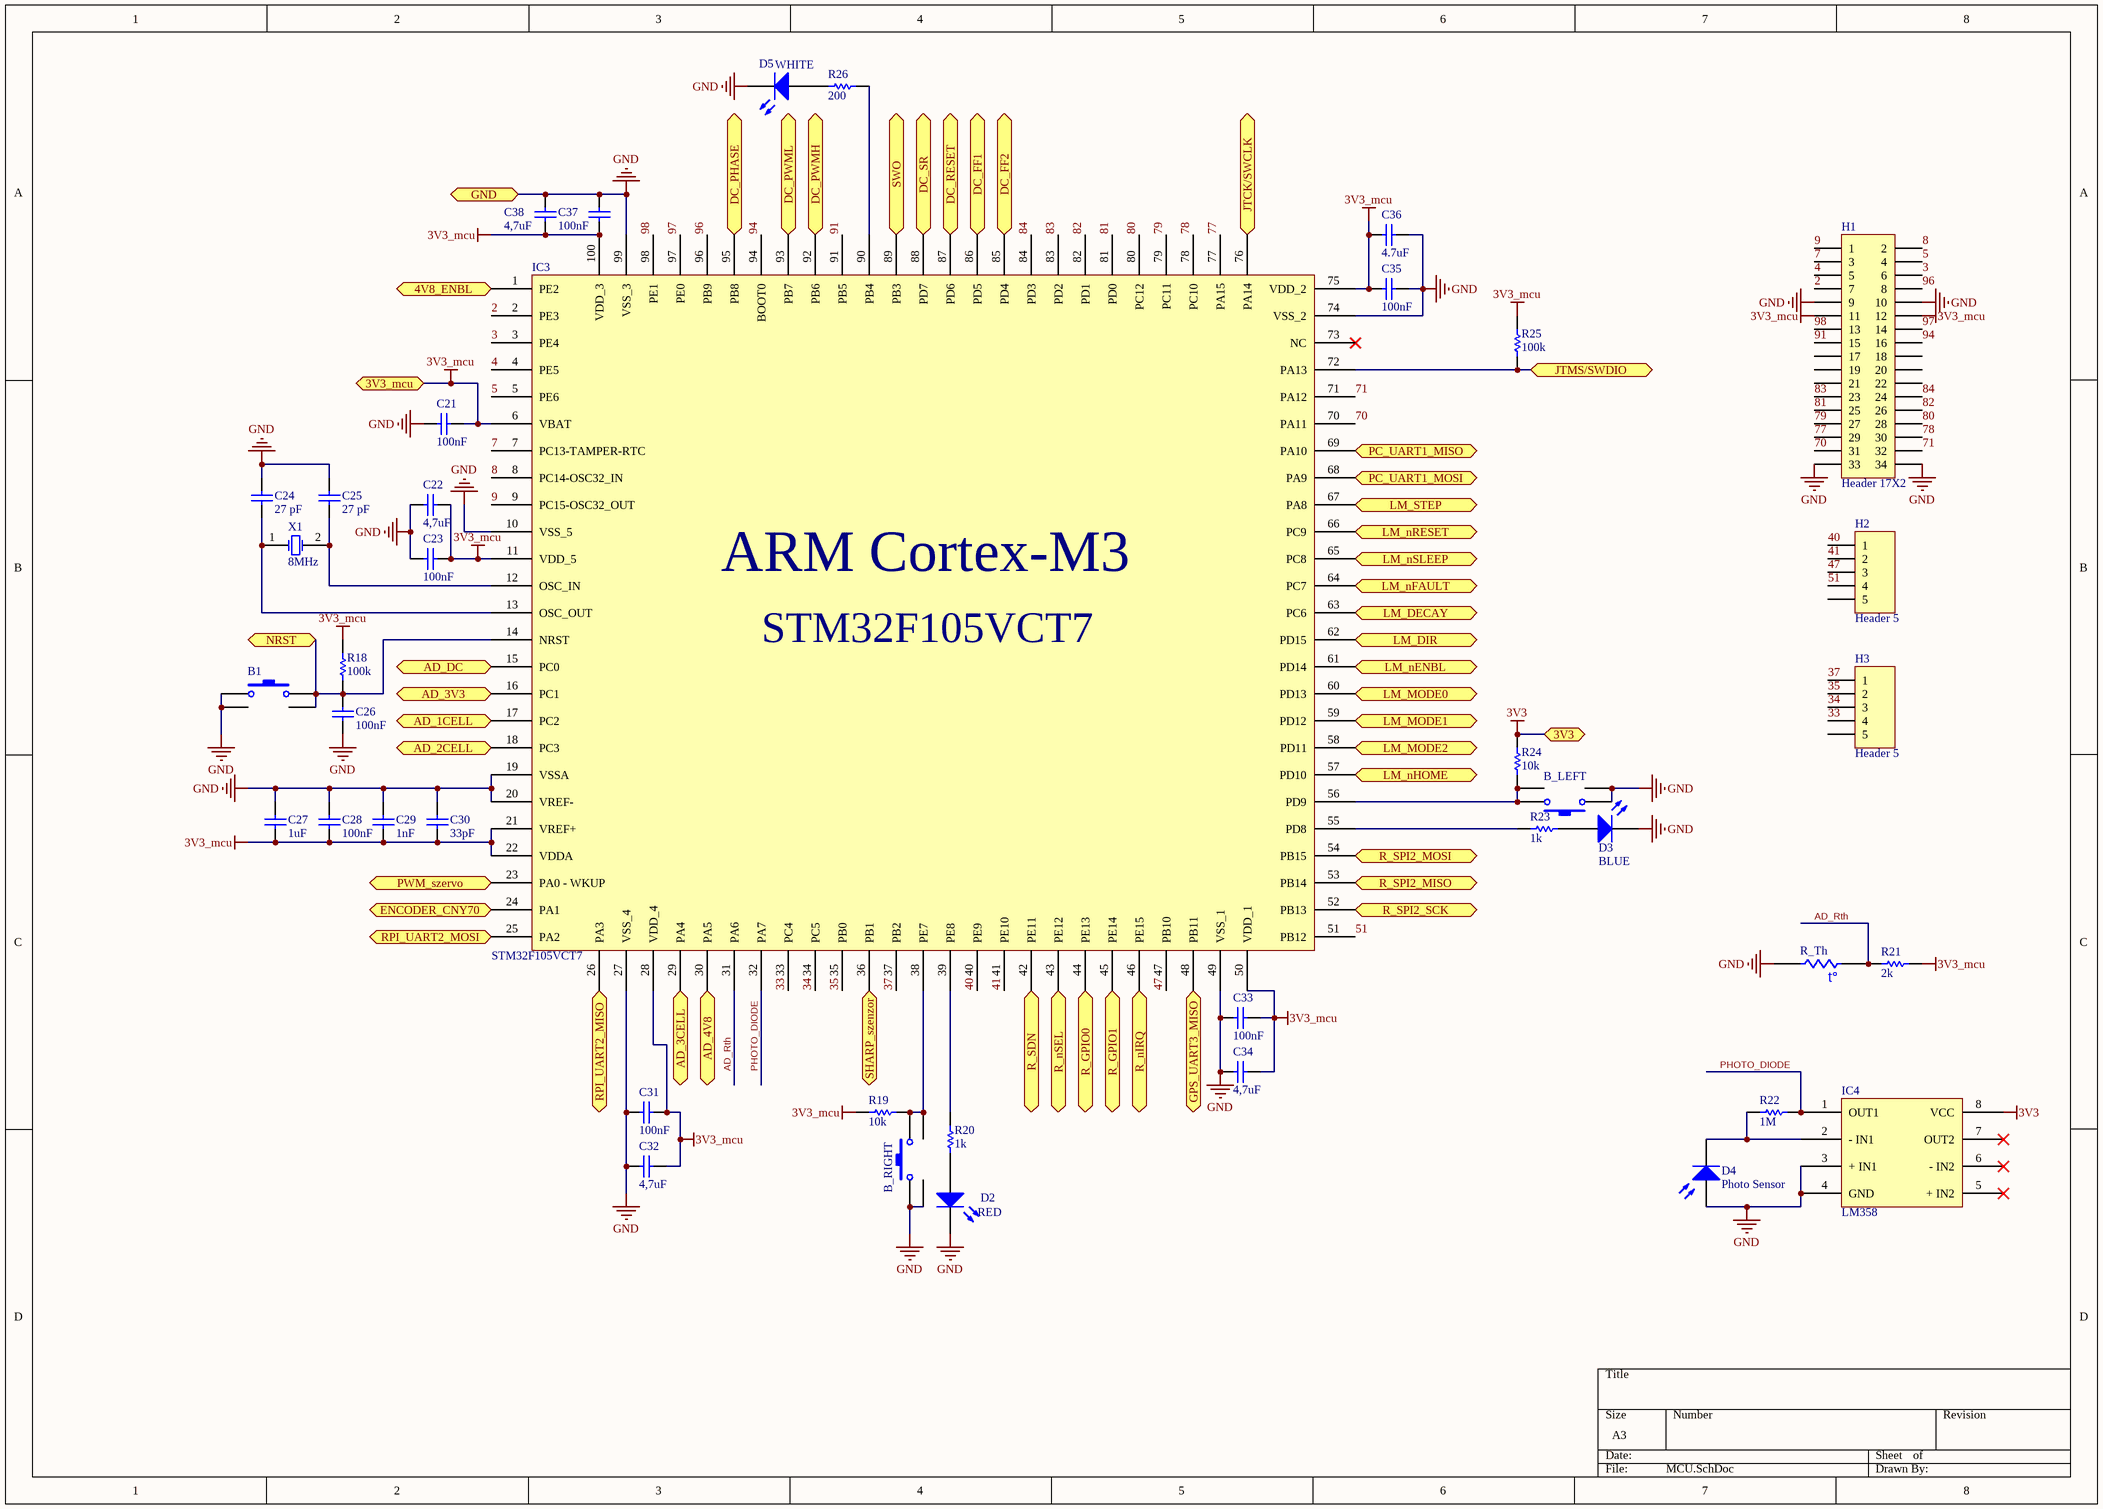
[diagram p7: MCU.SchDoc]

### Parts
B1  SW-PB  [6x6 button]  (value not drawn)
B_LEFT  SW-PB  [6x6 button]  (value not drawn)
B_RIGHT  SW-PB  [6x6 button]  (value not drawn)
C21  value 100nF  [FP_0603_CAP_080]  (hidden comment: Cap)
C22  value 4,7uF  [FP_0603_CAP_080]  (hidden comment: Cap)
C23  value 100nF  [FP_0603_CAP_080]  (hidden comment: Cap)
C24  value 27 pF  [FP_0603_CAP_080]  (hidden comment: Cap)
C25  value 27 pF  [FP_0603_CAP_080]  (hidden comment: Cap)
C26  value 100nF  [FP_0603_CAP_080]  (hidden comment: Cap)
C27  value 1uF  [FP_0603_CAP_080]  (hidden comment: Cap)
C28  value 100nF  [FP_0603_CAP_080]  (hidden comment: Cap)
C29  value 1nF  [FP_0603_CAP_080]  (hidden comment: Cap)
C30  value 33pF  [FP_0603_CAP_080]  (hidden comment: Cap)
C31  value 100nF  [FP_0603_CAP_080]  (hidden comment: Cap)
C32  value 4,7uF  [FP_0603_CAP_080]  (hidden comment: Cap)
C33  value 100nF  [FP_0603_CAP_080]  (hidden comment: Cap)
C34  value 4,7uF  [FP_0603_CAP_080]  (hidden comment: Cap)
C35  value 100nF  [FP_0603_CAP_080]  (hidden comment: Cap)
C36  value 4.7uF  [FP_0603_CAP_080]  (hidden comment: Cap)
C37  value 100nF  [FP_0603_CAP_080]  (hidden comment: Cap)
C38  value 4,7uF  [FP_0603_CAP_080]  (hidden comment: Cap)
D2  RED  [FP_1206_CAP_085]
D3  BLUE  [FP_1206_CAP_085]
D4  Photo Sensor  [FP_CONN2_TUSKE_254MM]
D5  WHITE  [FP_CONN2_TUSKE_254MM]
H1  Header 17X2  [HDR2X17]
H2  Header 5  [HDR1X5]
H3  Header 5  [HDR1X5]
IC3  STM32F105VCT7
IC4  LM358  [SO-8_M]
R18  value 100k  [FP_0603_RES]  (hidden comment: Res Semi)
R19  value 10k  [FP_0603_RES]  (hidden comment: Res Semi)
R20  value 1k  [FP_0603_RES]  (hidden comment: Res1)
R21  value 2k  [FP_0603_RES]  (hidden comment: Res1)
R22  value 1M  [FP_0603_RES]  (hidden comment: Res1)
R23  value 1k  [FP_0603_RES]  (hidden comment: Res1)
R24  value 10k  [FP_0603_RES]  (hidden comment: Res Semi)
R25  value 100k  [FP_0603_RES]  (hidden comment: Res Semi)
R26  value 200  [FP_0603_RES]  (hidden comment: Res1)
R_Th  Res Thermal  [HDR1X3]  (value not drawn)
X1  8MHz  [crystal_furatszerelt]

### Ports
3V3, 3V3_mcu, 4V8_ENBL (out), AD_1CELL (in), AD_2CELL (in), AD_3CELL (in), AD_3V3 (in), AD_4V8 (in), AD_DC (in), DC_FF1 (in), DC_FF2 (in), DC_PHASE (out), DC_PWMH (out), DC_PWML (out), DC_RESET (out), DC_SR (out), ENCODER_CNY70 (in), GND, GPS_UART3_MISO (in), JTCK/SWCLK (bidir), JTMS/SWDIO (bidir), LM_DECAY (out), LM_DIR (out), LM_MODE0 (out), LM_MODE1 (out), LM_MODE2 (out), LM_nENBL (out), LM_nFAULT (in), LM_nHOME (in), LM_nRESET (out), LM_nSLEEP (out), LM_STEP (out), NRST (bidir), PC_UART1_MISO (in), PC_UART1_MOSI (out), PWM_szervo (out), R_GPIO0 (bidir), R_GPIO1 (bidir), R_nIRQ (in), R_nSEL (out), R_SDN (out), R_SPI2_MISO (in), R_SPI2_MOSI (out), R_SPI2_SCK (out), RPI_UART2_MISO (in), RPI_UART2_MOSI (out), SHARP_szenzor (in), SWO (bidir)

### Nets
3V3: IC4.8(VCC) R24.1 ; port 3V3
3V3_mcu: C21.1 C22.1 C23.1 C27.2 C28.2 C29.2 C30.2 C31.1 C32.1 C33.1 C34.1 C35.1 C36.1 C37.1 C38.2 H1.11 H1.12 IC3.6(VBAT) IC3.11(VDD_5) IC3.21(VREF+) IC3.22(VDDA) IC3.28(VDD_4) IC3.50(VDD_1) IC3.75(VDD_2) IC3.100(VDD_3) R18.1 R19.2 R21.1 R25.2 ; port 3V3_mcu
GND: B1.1 B_LEFT.1 B_RIGHT.1 C21.2 C22.2 C23.2 C24.1 C25.1 C26.1 C27.1 C28.1 C29.1 C30.1 C31.2 C32.2 C33.2 C34.2 C35.2 C36.2 C37.2 C38.1 D2.2(K) D3.2(K) D4.1(A) D5.2(K) H1.9 H1.10 H1.33 H1.34 IC3.10(VSS_5) IC3.19(VSSA) IC3.20(VREF-) IC3.27(VSS_4) IC3.49(VSS_1) IC3.74(VSS_2) IC3.99(VSS_3) IC4.3(+_IN1) IC4.4(GND) R_Th.3 ; port GND
2: H1.7 IC3.2(PE3)
3: H1.6 IC3.3(PE4)
4: H1.5 IC3.4(PE5)
5: H1.4 IC3.5(PE6)
7: H1.3 IC3.7(PC13-TAMPER-RTC)
8: H1.2 IC3.8(PC14-OSC32_IN)
9: H1.1 IC3.9(PC15-OSC32_OUT)
33: H3.4 IC3.33(PC4)
34: H3.3 IC3.34(PC5)
35: H3.2 IC3.35(PB0)
37: H3.1 IC3.37(PB2)
40: H2.1 IC3.40(PE9)
41: H2.2 IC3.41(PE10)
47: H2.3 IC3.47(PB10)
51: H2.4 IC3.51(PB12)
70: H1.31 IC3.70(PA11)
71: H1.32 IC3.71(PA12)
77: H1.29 IC3.77(PA15)
78: H1.30 IC3.78(PC10)
79: H1.27 IC3.79(PC11)
80: H1.28 IC3.80(PC12)
81: H1.25 IC3.81(PD0)
82: H1.26 IC3.82(PD1)
83: H1.23 IC3.83(PD2)
84: H1.24 IC3.84(PD3)
91: H1.15 IC3.91(PB5)
94: H1.16 IC3.94(BOOT0)
96: H1.8 IC3.96(PB9)
97: H1.14 IC3.97(PE0)
98: H1.13 IC3.98(PE1)
AD_Rth: IC3.31(PA6) R21.2 R_Th.1
PHOTO_DIODE: IC3.32(PA7) IC4.1(OUT1) R22.2
NetB1_2: B1.2 C26.2 IC3.14(NRST) R18.2 ; port NRST
NetB_LEFT_2: B_LEFT.2 IC3.56(PD9) R24.2
NetB_RIGHT_2: B_RIGHT.2 IC3.38(PE7) R19.1
NetC24_2: C24.2 IC3.13(OSC_OUT) X1.1(OSC1)
NetC25_2: C25.2 IC3.12(OSC_IN) X1.2(OSC2)
NetD2_1: D2.1(A) R20.2
NetD3_1: D3.1(A) R23.1
NetD4_2: D4.2(K) IC4.2(-_IN1) R22.1
NetD5_1: D5.1(A) R26.1
NetGPS_3: IC3.48(PB11) ; port GPS_UART3_MISO
NetIC2_7: IC3.1(PE2) ; port 4V8_ENBL
NetIC3_15: IC3.15(PC0) ; port AD_DC
NetIC3_16: IC3.16(PC1) ; port AD_3V3
NetIC3_17: IC3.17(PC2) ; port AD_1CELL
NetIC3_18: IC3.18(PC3) ; port AD_2CELL
NetIC3_23: IC3.23(PA0_-_WKUP) ; port PWM_szervo
NetIC3_24: IC3.24(PA1) ; port ENCODER_CNY70
NetIC3_25: IC3.25(PA2) ; port RPI_UART2_MOSI
NetIC3_26: IC3.26(PA3) ; port RPI_UART2_MISO
NetIC3_29: IC3.29(PA4) ; port AD_3CELL
NetIC3_30: IC3.30(PA5) ; port AD_4V8
NetIC3_36: IC3.36(PB1) ; port SHARP_szenzor
NetIC3_39: IC3.39(PE8) R20.1
NetIC3_42: IC3.42(PE11) ; port R_SDN
NetIC3_43: IC3.43(PE12) ; port R_nSEL
NetIC3_44: IC3.44(PE13) ; port R_GPIO0
NetIC3_45: IC3.45(PE14) ; port R_GPIO1
NetIC3_46: IC3.46(PE15) ; port R_nIRQ
NetIC3_52: IC3.52(PB13) ; port R_SPI2_SCK
NetIC3_53: IC3.53(PB14) ; port R_SPI2_MISO
NetIC3_54: IC3.54(PB15) ; port R_SPI2_MOSI
NetIC3_55: IC3.55(PD8) R23.2
NetIC3_57: IC3.57(PD10) ; port LM_nHOME
NetIC3_58: IC3.58(PD11) ; port LM_MODE2
NetIC3_59: IC3.59(PD12) ; port LM_MODE1
NetIC3_60: IC3.60(PD13) ; port LM_MODE0
NetIC3_61: IC3.61(PD14) ; port LM_nENBL
NetIC3_62: IC3.62(PD15) ; port LM_DIR
NetIC3_63: IC3.63(PC6) ; port LM_DECAY
NetIC3_64: IC3.64(PC7) ; port LM_nFAULT
NetIC3_65: IC3.65(PC8) ; port LM_nSLEEP
NetIC3_66: IC3.66(PC9) ; port LM_nRESET
NetIC3_67: IC3.67(PA8) ; port LM_STEP
NetIC3_68: IC3.68(PA9) ; port PC_UART1_MOSI
NetIC3_69: IC3.69(PA10) ; port PC_UART1_MISO
NetIC3_72: IC3.72(PA13) R25.1 ; port JTMS/SWDIO
NetIC3_76: IC3.76(PA14) ; port JTCK/SWCLK
NetIC3_85: IC3.85(PD4) ; port DC_FF2
NetIC3_86: IC3.86(PD5) ; port DC_FF1
NetIC3_87: IC3.87(PD6) ; port DC_RESET
NetIC3_88: IC3.88(PD7) ; port DC_SR
NetIC3_89: IC3.89(PB3) ; port SWO
NetIC3_90: IC3.90(PB4) R26.2
NetIC3_92: IC3.92(PB6) ; port DC_PWMH
NetIC3_93: IC3.93(PB7) ; port DC_PWML
NetIC3_95: IC3.95(PB8) ; port DC_PHASE

Not connected (* = marked no-connect by the designer): H1 17 18 19 20 21 22; H2 5; H3 5; IC3 73(NC)*; IC4 5(+_IN2)* 6(-_IN2)* 7(OUT2)*

### Notes on the sheet
- (in symbol Res Thermal) t°
- (in symbol STM32F105xx) ARM Cortex-M3

### Library data of the parts
B1 B_LEFT B_RIGHT = SW-PB: Switch; Published: 24-Mar-1999; LatestRevisionDate: 17-Jul-2002; LatestRevisionNote: Re-released for DXP Platform.; PackageReference: SPST-2; Publisher: Altium Limited; PackageDescription: Switch; 2 Leads
C21-C38 = Cap: Capacitor; Published: 8-Jun-2000; LatestRevisionDate: 17-Jul-2002; LatestRevisionNote: Re-released for DXP Platform.; PackageReference: RAD-0.3; Publisher: Altium Limited; PackageDescription: Radial Cap, Thru-Hole; 2 Leads; 0.3 in Pin Spacing
D2 D3 D5 = LED0: Typical INFRARED GaAs LED; Published: 8-Jun-2000; LatestRevisionDate: 08-Jul-2005; LatestRevisionNote: Mech Layer 1 removed.; PackageReference: LED-0; Publisher: Altium Limited; PackageDescription: LED; 2 Leads
D4 = Photo Sen: Photosensitive Diode; Published: 24-Mar-1999; LatestRevisionDate: 17-Jul-2002; LatestRevisionNote: Re-released for DXP Platform.; PackageReference: PIN2; Publisher: Altium Limited
H1 = Header 17X2: Header, 17-Pin, Dual row; LatestRevisionDate: 17-Jul-2002; LatestRevisionNote: Re-released for DXP Platform.; Publisher: Altium Limited
H2 H3 = Header 5: Header, 5-Pin; LatestRevisionDate: 17-Jul-2002; LatestRevisionNote: Re-released for DXP Platform.; Publisher: Altium Limited
IC3 = STM32F105xx
R18 R19 R24 R25 = Res Semi: Semiconductor Resistor; Published: 8-Jun-2000; LatestRevisionDate: 17-Jul-2002; LatestRevisionNote: Re-released for DXP Platform.; PackageReference: AXIAL-0.5; Publisher: Altium Limited; PackageDescription: Axial Device, Thru-Hole; 2 Leads; 0.5 in Pin Spacing
R20-R23 R26 = Res1: Resistor; Published: 8-Jun-2000; LatestRevisionDate: 17-Jul-2002; LatestRevisionNote: Re-released for DXP Platform.; PackageReference: AXIAL-0.3; Publisher: Altium Limited; PackageDescription: Axial Device, Thru-Hole; 2 Leads; 0.3 in Pin Spacing
R_Th = Res Thermal: Thermistor; Published: 24-Mar-1999; LatestRevisionDate: 29-May-2009; LatestRevisionNote: IPC-7351 Footprint Added.; PackageVersion: Mar-2003; PackageReference: 6-0805; Publisher: Altium Limited; PackageDescription: Chip Resistor 0805 Case Size; Code_IPC: RESC2012
X1 = XTAL: Crystal Oscillator; Published: 8-Jun-2000; LatestRevisionDate: 17-Jul-2002; LatestRevisionNote: Re-released for DXP Platform.; PackageReference: R38; Publisher: Altium Limited; PackageDescription: Crystal, Thru-Hole; 2 Leads; Body 3.1 x 8.2 mm (Dia.xH)

## Nets that join several sheets
3V3: Connectors (C82.1 CNY70.1 CNY70.2 GPS.1), Power_input (11 pins), MCU (IC4.8 R24.1)
3V3_dc: DC_motor_driver (8 pins), Power_input (Rdc.1)
3V3_mcu: Power_input (Rmcu.1), MCU (29 pins)
3V3_radio: Radio_communication (6 pins), Power_input (Rradio.1)
3V3_uart: Debug_UART (C39.2 IC5.16), Power_input (Ruart.1)
4V8: Connectors (7 pins), Power_input (6 pins)
11V1: DC_motor_driver (10 pins), Stepper_motor_driver (9 pins), Power_input (5 pins)
GND: Connectors (16 pins), DC_motor_driver (27 pins), Debug_UART (7 pins), Radio_communication (14 pins), Stepper_motor_driver (13 pins), Power_input (30 pins), MCU (39 pins)
NetB1_2: Connectors (R61.2), MCU (B1.2 C26.2 IC3.14 R18.2)
NetGPS_3: Connectors (GPS.3), MCU (IC3.48)
NetIC2_7: Power_input (IC2.7), MCU (IC3.1)
NetIC3_15: DC_motor_driver (IC11.5 IC11.6), MCU (IC3.15)
NetIC3_16: Power_input (R16.1 R17.2), MCU (IC3.16)
NetIC3_17: Power_input (R8.1 R9.2), MCU (IC3.17)
NetIC3_18: Power_input (R10.1 R11.2), MCU (IC3.18)
NetIC3_23: Connectors (Szervo.3), MCU (IC3.23)
NetIC3_24: Connectors (R56.2), MCU (IC3.24)
NetIC3_25: Connectors (UART_RPI.1), MCU (IC3.25)
NetIC3_26: Connectors (UART_RPI.2), MCU (IC3.26)
NetIC3_29: Power_input (R12.1 R13.2), MCU (IC3.29)
NetIC3_30: Power_input (R14.1 R15.2), MCU (IC3.30)
NetIC3_36: Connectors (SHARP_szenzor.1), MCU (IC3.36)
NetIC3_42: Radio_communication (IC6.1), MCU (IC3.42)
NetIC3_43: Radio_communication (IC6.15), MCU (IC3.43)
NetIC3_44: Radio_communication (IC6.9), MCU (IC3.44)
NetIC3_45: Radio_communication (IC6.10), MCU (IC3.45)
NetIC3_46: Radio_communication (IC6.11), MCU (IC3.46)
NetIC3_52: Radio_communication (IC6.12), MCU (IC3.52)
NetIC3_53: Radio_communication (IC6.13), MCU (IC3.53)
NetIC3_54: Radio_communication (IC6.14), MCU (IC3.54)
NetIC3_57: Stepper_motor_driver (IC7.27 R31.1), MCU (IC3.57)
NetIC3_58: Stepper_motor_driver (IC7.26), MCU (IC3.58)
NetIC3_59: Stepper_motor_driver (IC7.25), MCU (IC3.59)
NetIC3_60: Stepper_motor_driver (IC7.24), MCU (IC3.60)
NetIC3_61: Stepper_motor_driver (IC7.21), MCU (IC3.61)
NetIC3_62: Stepper_motor_driver (IC7.20), MCU (IC3.62)
NetIC3_63: Stepper_motor_driver (IC7.19), MCU (IC3.63)
NetIC3_64: Stepper_motor_driver (IC7.18 R30.1), MCU (IC3.64)
NetIC3_65: Stepper_motor_driver (IC7.17), MCU (IC3.65)
NetIC3_66: Stepper_motor_driver (IC7.16), MCU (IC3.66)
NetIC3_67: Stepper_motor_driver (IC7.22), MCU (IC3.67)
NetIC3_68: Debug_UART (IC5.10), MCU (IC3.68)
NetIC3_69: Debug_UART (IC5.9), MCU (IC3.69)
NetIC3_72: Connectors (R60.2), MCU (IC3.72 R25.1)
NetIC3_76: Connectors (R59.2), MCU (IC3.76)
NetIC3_85: DC_motor_driver (IC8.26 R40.1 R41.2), MCU (IC3.85)
NetIC3_86: DC_motor_driver (IC8.25 R38.1 R39.2), MCU (IC3.86)
NetIC3_87: DC_motor_driver (IC8.24), MCU (IC3.87)
NetIC3_88: DC_motor_driver (IC8.21), MCU (IC3.88)
NetIC3_89: Connectors (R62.2), MCU (IC3.89)
NetIC3_92: DC_motor_driver (IC8.23), MCU (IC3.92)
NetIC3_93: DC_motor_driver (IC8.22), MCU (IC3.93)
NetIC3_95: DC_motor_driver (IC8.19), MCU (IC3.95)